# Altium schematic sheet PT_Buffer.SchDoc
size A4
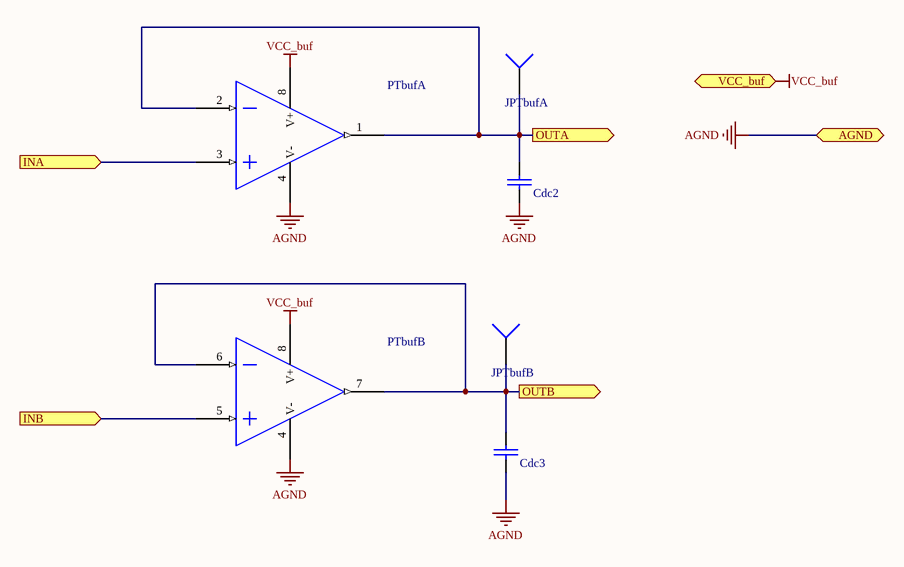
[diagram p0: PT_Buffer.SchDoc]

## Parts
Cdc2  47nF  [ECE-CAPC2012-0805SM]  (value not drawn)
Cdc3  47nF  [ECE-CAPC2012-0805SM]  (value not drawn)
JPTbufA  TEST PIN  [ECE-HDR1TH]  (value not drawn)
JPTbufB  TEST PIN  [ECE-HDR1TH]  (value not drawn)
PTbuf  LT6221  [ECE-SO8]  (value not drawn)  (parts A,B of 2)

## Ports
AGND, INA (in), INB (in), OUTA (out), OUTB (out), VCC_buf (in)

## Nets
AGND: Cdc2.2 Cdc3.2 PTbuf.4(V-) ; port AGND
VCC_buf: PTbuf.8(V+) ; port VCC_buf
INA: PTbuf.3(IN1(+)) ; port INA
INB: PTbuf.5(IN2(+)) ; port INB
OUTA: Cdc2.1 JPTbufA.1 PTbuf.1(OUT1) PTbuf.2(IN1(-)) ; port OUTA
OUTB: Cdc3.1 JPTbufB.1 PTbuf.6(IN2(-)) PTbuf.7(OUT2) ; port OUTB

## Library data of the parts
Cdc2 Cdc3 = CAP000522: CAP CER 47nF 50V X7R SM0805; Manufactuer: Samsung; Manufacturer-PN: CL21B473KBCNNNC; Assembly Method: Surface Mount; Item Type: Item; Path: ece/ts/Lists/Stock Inventory; Value: 47nF; UoA Stock#: CAP000522; Size/Package: 0805 (2012 Metric); Voltage/Current: 50V; Supplier1: Digikey; Supplier1-PN: 1276-1250-2-ND; Component Type: CAP-0805-47nF; Category: Capacitor; Status: Active
JPTbufA JPTbufB = CON000017: Value: 1 way; Assembly Method: Through hole; Item Type: Item; Path: ece/ts/Lists/Stock Inventory; UoA Stock#: CON000017; Component Type: NA; Category: Connector; Status: Active
PTbuf = OPA000102: IC OPAMP LT6221 DUAL SM; Manufactuer: Linear Technology; Manufacturer-PN: LT6221CS8#TRPBF; Assembly Method: Surface Mount; Item Type: Item; Path: ece/ts/Lists/Stock Inventory; UoA Stock#: OPA000102; Value: LT6221; Size/Package: S8; Datasheet Link: http://share.engineering.auckland.ac.nz/ece/ts/Student%20Documents/LT6221.pdf; Supplier1: Arrow; Supplier1-PN: LT6221CS8#TRPBF; Supplier2: Digikey; Supplier2-PN: LT6221CS8#PBF-ND; Component Type: S8-LT6221; Category: OpAmp; Status: Active